# Altium schematic sheet Sensors.SchDoc
size A; SheetNumber: 4; SheetTotal: 7
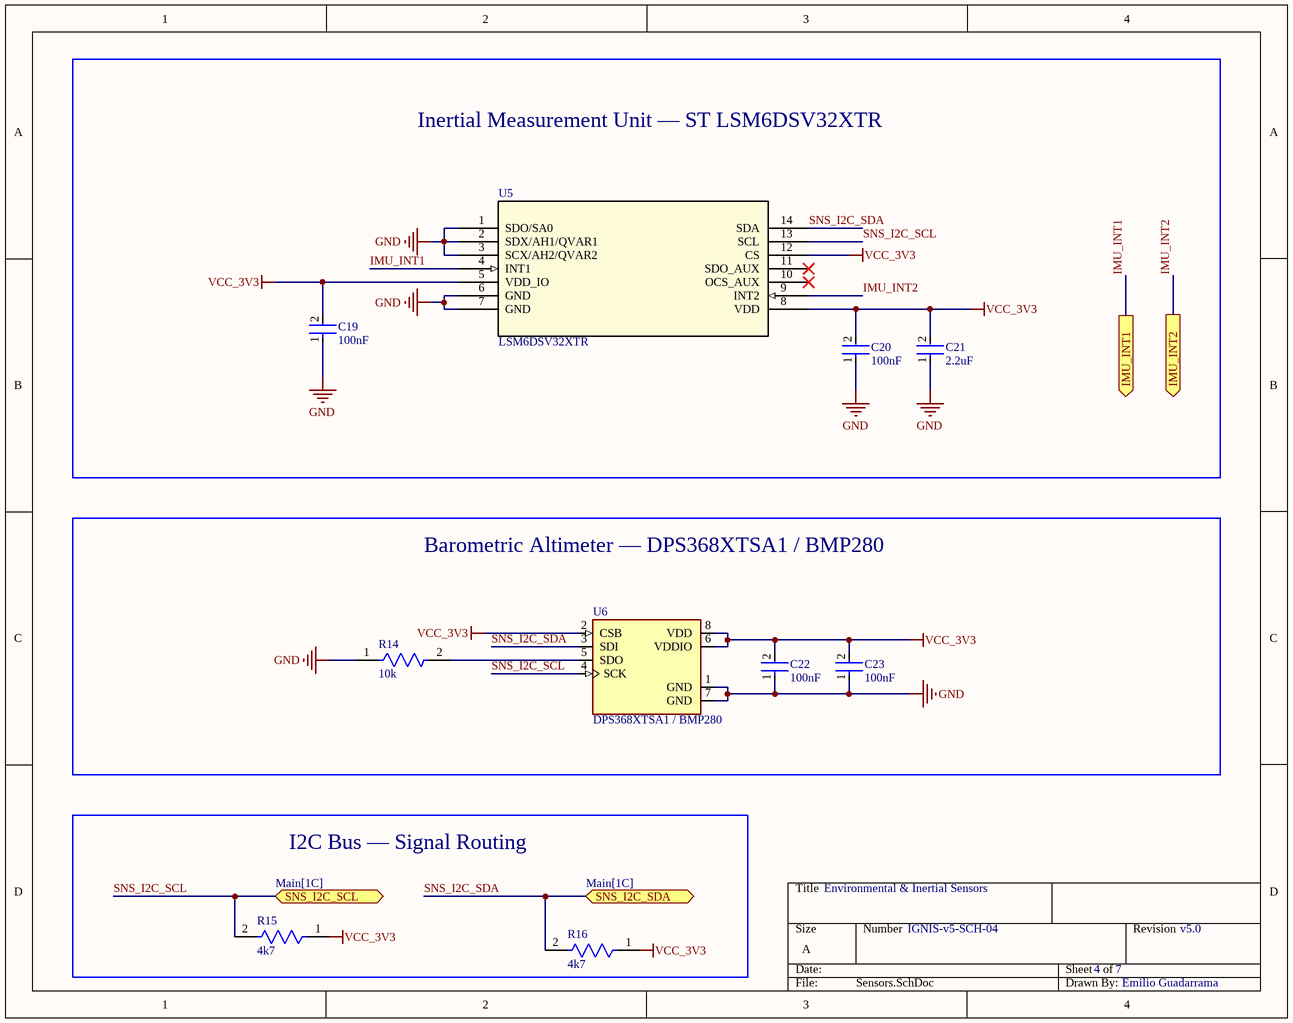
[diagram p0: Sensors.SchDoc]

## Parts
C19  100nF  [FP-C0805C-DN-MFG]
C20  100nF  [FP-C0805C-DN-MFG]
C21  2.2uF  [FP-C0805C-DN-MFG]
C22  100nF  [FP-C0805C-DN-MFG]
C23  100nF  [FP-C0805C-DN-MFG]
R14  10k  [FP-MCT0603-IPC_A]
R15  4k7  [FP-MCT0603-IPC_A]
R16  4k7  [FP-MCT0603-IPC_A]
U5  LSM6DSV32XTR  [LGA-14L_2p5X3p0X0p86_STM]
U6  DPS368XTSA1 / BMP280  [XDCR_BMP280]

## Blocks framed on the sheet
Inertial Measurement Unit — ST LSM6DSV32XTR: C19-C21 U5
Barometric Altimeter — DPS368XTSA1 / BMP280: C22 C23 R14 U6
I2C Bus — Signal Routing: R15 R16

## Ports
IMU_INT1 (out), IMU_INT2 (out), SNS_I2C_SCL (bidir, see Main[1C]), SNS_I2C_SDA (bidir, see Main[1C])

## Nets
GND: C19.1 C20.1 C21.1 C22.1 C23.1 R14.1 U5.1(SDO/SA0) U5.2(SDX/AH1/QVAR1) U5.3(SCX/AH2/QVAR2) U5.6(GND) U5.7(GND) U6.1(GND) U6.7(GND)
VCC_3V3: C19.2 C20.2 C21.2 C22.2 C23.2 R15.1 R16.1 U5.5(VDD_IO) U5.8(VDD) U5.12(CS) U6.2(CSB) U6.6(VDDIO) U6.8(VDD)
IMU_INT1: U5.4(INT1) ; port IMU_INT1
IMU_INT2: U5.9(INT2) ; port IMU_INT2
SNS_I2C_SCL: R15.2 U5.13(SCL) U6.4(SCK) ; port SNS_I2C_SCL
SNS_I2C_SDA: R16.2 U5.14(SDA) U6.3(SDI) ; port SNS_I2C_SDA
NetR14_2: R14.2 U6.5(SDO)

Not connected (* = marked no-connect by the designer): U5 10(OCS_AUX)* 11(SDO_AUX)*

## Notes on the sheet
- Environmental & Inertial Sensors
- IGNIS-v5-SCH-04
- 4
- 7
- v5.0
- Emilio Guadarrama

## Library data of the parts
C19 C20 = CMP-2007-00279-2: CAP CER 0.1UF 50V X7R 0805; Manufacturer Part Number: C0805C104K5RACTU; Manufacturer: KEMET; Tolerance: 0.1; Temperature Coefficient: 30ppm/°C; Material: Ceramic; Capacitance: 0.10 μF; Device Class L2: Capacitors; Temperature Range Low: -55°C; Voltage Rating: 50 V; Digikey Description: CAP CER 0.1UF 50V X7R 0805; Value: 100 nF; Category: Cap; ComponentLink2Description: Datasheet; Octopart: https://octopart.com/c0805c104k5ractu-kemet-143926; RoHS: TRUE; ComponentLink2URL: https://content.kemet.com/datasheets/KEM_C1003_C0G_SMD.pdf; Temperature Characteristic: X7R; Temperature: -55°C to +125°C; Height: 0.88mm; Temperature Range High: +125°C; Device Class L1: Passive Components; Automotive: No; Lead Free: Yes; Ipc Land Pattern Name: CAPC200125X78; Device Class L3: Ceramic Capacitors; Mouser Description: Cap Ceramic 0.1uF 50V X7R 10% SMD 2.0 x 1.2 mm 125 C Paper T/R; Package: C0805C-DN
C21 = CMP-2007-00279-2: CAP CER 0.1UF 50V X7R 0805; Manufacturer Part Number: C0805C104K5RACTU; Manufacturer: KEMET; Value: 100 nF; Tolerance: 0.1; Temperature Coefficient: 30ppm/°C; Material: Ceramic; Capacitance: 0.10 μF; Device Class L2: Capacitors; Temperature Range Low: -55°C; Voltage Rating: 50 V; Digikey Description: CAP CER 0.1UF 50V X7R 0805; Category: Cap; ComponentLink2Description: Datasheet; Octopart: https://octopart.com/c0805c104k5ractu-kemet-143926; RoHS: TRUE; ComponentLink2URL: https://content.kemet.com/datasheets/KEM_C1003_C0G_SMD.pdf; Temperature Characteristic: X7R; Temperature: -55°C to +125°C; Height: 0.88mm; Temperature Range High: +125°C; Device Class L1: Passive Components; Automotive: No; Lead Free: Yes; Ipc Land Pattern Name: CAPC200125X78; Device Class L3: Ceramic Capacitors; Mouser Description: Cap Ceramic 0.1uF 50V X7R 10% SMD 2.0 x 1.2 mm 125 C Paper T/R; Package: C0805C-DN
C22 C23 = CMP-2007-00279-2: CAP CER 0.1UF 50V X7R 0805; Manufacturer Part Number: C0805C104K5RACTU; Manufacturer: KEMET; Tolerance: 0.1; Temperature Coefficient: 30ppm/°C; Material: Ceramic; Device Class L2: Capacitors; Temperature Range Low: -55°C; Voltage Rating: 50 V; Digikey Description: CAP CER 0.1UF 50V X7R 0805; Value: 100 nF; Category: Cap; ComponentLink2Description: Datasheet; Octopart: https://octopart.com/c0805c104k5ractu-kemet-143926; RoHS: TRUE; ComponentLink2URL: https://content.kemet.com/datasheets/KEM_C1003_C0G_SMD.pdf; Temperature Characteristic: X7R; Temperature: -55°C to +125°C; Height: 0.88mm; Temperature Range High: +125°C; Device Class L1: Passive Components; Automotive: No; Lead Free: Yes; Ipc Land Pattern Name: CAPC200125X78; Device Class L3: Ceramic Capacitors; Mouser Description: Cap Ceramic 0.1uF 50V X7R 10% SMD 2.0 x 1.2 mm 125 C Paper T/R; Capacitance: 100 nF; Package: C0805C-DN
R14-R16 = CMP-02407-011165-1: RES SMD 100 OHM 1% 1/8W 0603; Temperature Coefficient: 25ppm/°C; Resistance: 4.7kR; Power Rating: 125mW; Tolerance: 0.1%; Voltage Rating: 75V; Length: 1.55mm; Case Code (Imperial): 0603; Case/Package: 0603; Construction: Rectangular; Package Quantity: 1000; Number of Terminations: 2; Termination: SMD/SMT; Resistor Type: Thin Film; Features: Automotive AEC-Q200; Series: MCT 0603 - Precision; Max Operating Temperature: 155°C; Depth: 0.85mm; Max Power Dissipation: 125mW; Min Operating Temperature: -55°C; Width: 0.033inch; Case Code (Metric): 1608; Packaging: Tape and Reel; Weight: 6.7E-05oz; Military Standard: Not; Height: 0.022inch
U5 = LSM6DSV32XTR: 6-axis IMU (inertial measurement unit) with 32 g accelerometer and embedded sensor fusion, AI, Qvar for high-end applications; Manufacturer_Name: STMicroelectronics; Type: Motion Sensors; Copyright: Copyright (C) 2026 Ultra Librarian. All rights reserved.; Manufacturer_Part_Number: LSM6DSV32XTR; RefDes: RefDes
U6 = BMP280: BMP280 Absolute Barometric Pressure Sensor for Battery Powered Devices 2 x 2.5mm; Package: None; Availability: Unavailable; MP: BMP280; Value: *; Price: None